# EAGLE schematic 1.0 (EAGLE 9.3.2)
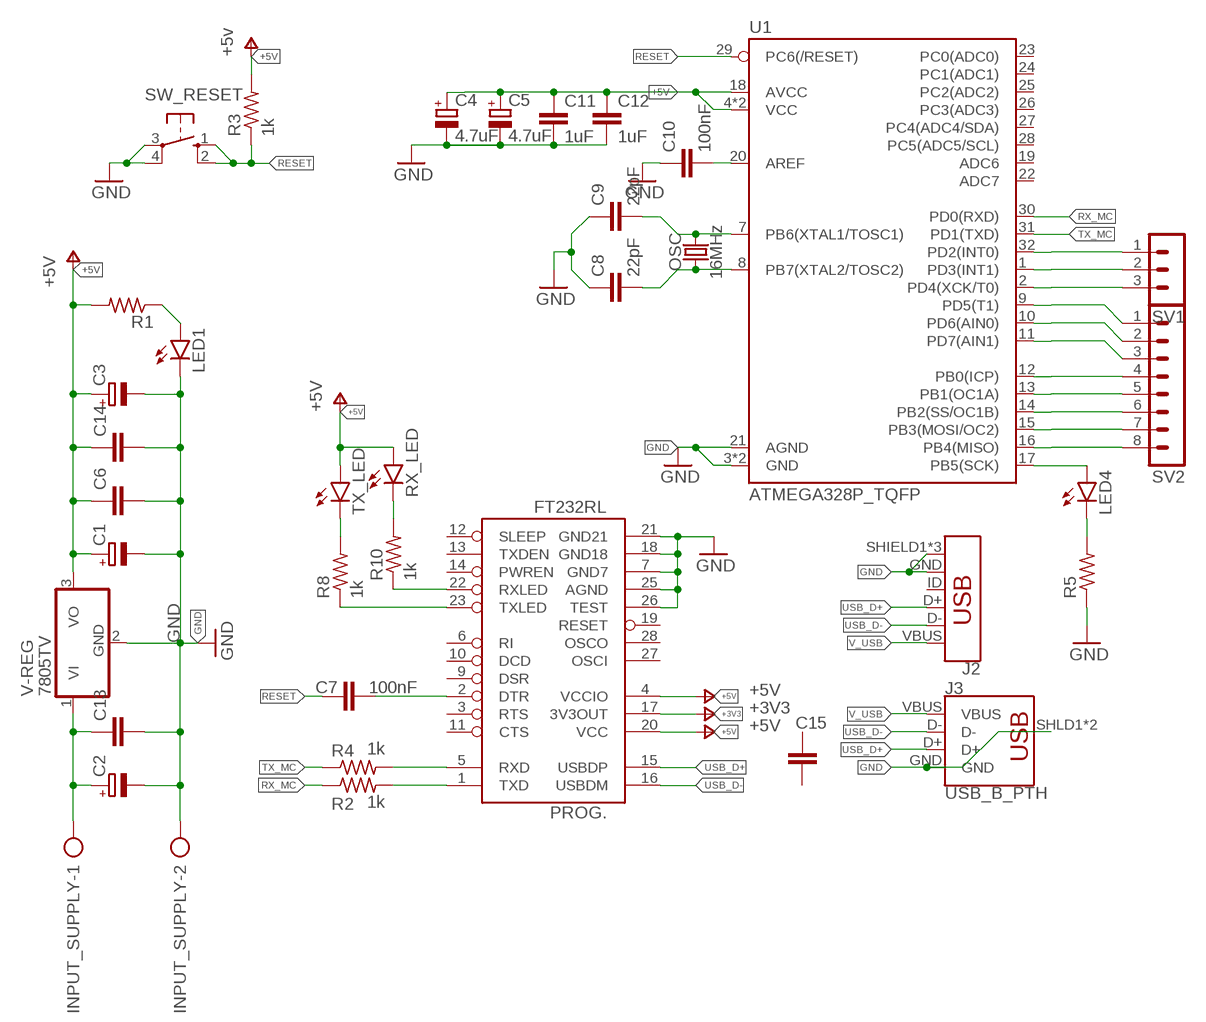
[diagram p0: schematic, sheet 1]

## Parts
C1  CPOL-EUE5-10.5  [E5-10,5]
C2  CPOL-EUE5-10.5  [E5-10,5]
C3  CPOL-EUE5-10.5  [E5-10,5]
C4  4.7uF  CPOL-EUE5-10.5  [E5-10,5]
C5  4.7uF  CPOL-EUE5-10.5  [E5-10,5]
C6  C-EU050-030X075  [C050-030X075]
C7  100nF  C-EU050-030X075  [C050-030X075]
C8  22pF  C-EU050-030X075  [C050-030X075]
C9  22pF  C-EU050-030X075  [C050-030X075]
C10  100nF  C-EU050-030X075  [C050-030X075]
C11  1uF  C-EU050-030X075  [C050-030X075]
C12  1uF  C-EU050-030X075  [C050-030X075]
C13  C-EU050-030X075  [C050-030X075]
C14  C-EU050-030X075  [C050-030X075]
C15  C-EU050-030X075  [C050-030X075]
INPUT_SUPPLY  SMKDSP_1,5/2  [SMKDSP_1,5/2]
J2  USB_MICRO-B_FEMALE-SMT  [USB-B-MICRO-SMD]
J3  USB_B_PTH  [USB-B-PTH]
LED1  LED5MM  [LED5MM]
LED4  LED5MM  [LED5MM]
OSC  16MHz  CRYSTALPTH-HC49UV  [HC49U]
PROG.  FT232RL  FT232RLSSOP  [SSOP28DB]
R1  R-US_0207/10  [0207/10]
R2  1k  R-US_0207/10  [0207/10]
R3  1k  R-US_0207/10  [0207/10]
R4  1k  R-US_0207/10  [0207/10]
R5  R-US_0207/10  [0207/10]
R8  1k  R-US_0207/10  [0207/10]
R10  1k  R-US_0207/10  [0207/10]
RX_LED  LED5MM  [LED5MM]
SV1  MA03-1  [MA03-1]
SV2  MA08-1  [MA08-1]
SW_RESET  10-XX  [B3F-10XX]
TX_LED  LED5MM  [LED5MM]
U1  ATMEGA328P_TQFP  [TQFP32-08]
V-REG  7805TV  [TO220V]

## Nets
+3V3: PROG..17(3V3OUT)
+5V: C1.+ C3.+ C4.+ C5.+ C6.1 C11.1 C12.1 C14.1 PROG..4(VCCIO) PROG..20(VCC) R1.2 R3.2 RX_LED.A TX_LED.A U1.4(VCC) U1.6(VCC) U1.18(AVCC) V-REG.3(VO) ; supply symbol labelled +5v
GND: C1.- C2.- C3.- C4.- C5.- C6.2 C8.1 C9.1 C10.1 C11.2 C12.2 C13.2 C14.2 INPUT_SUPPLY.2 J2.GND J2.SHIELD1(SHIELD) J2.SHIELD2(SHIELD) J2.SHIELD3(SHIELD) J3.GND J3.SHLD1(SHIELD) J3.SHLD2(SHIELD) LED1.K(C) PROG..7(GND7) PROG..18(GND18) PROG..21(GND21) PROG..25(AGND) PROG..26(TEST) R5.1 SW_RESET.3(P) SW_RESET.4(P1) U1.3(GND) U1.5(GND) U1.21(AGND) V-REG.2(GND)
N$1: C2.+ C13.1 INPUT_SUPPLY.1 V-REG.1(VI)
N$2: LED1.A R1.1
N$3: PROG..5(RXD) R4.2
N$4: PROG..1(TXD) R2.2
N$5: C7.2 PROG..2(DTR)
N$6: C9.2 OSC.2 U1.7(PB6(XTAL1/TOSC1))
N$7: C8.2 OSC.1 U1.8(PB7(XTAL2/TOSC2))
N$8: PROG..22(RXLED) R10.1
N$9: PROG..23(TXLED) R8.1
N$10: R8.2 TX_LED.K(C)
N$11: R10.2 RX_LED.K(C)
N$12: C10.2 U1.20(AREF)
N$13: LED4.K(C) R5.2
N$14: LED4.A U1.17(PB5(SCK))
N$15: SV1.1 U1.32(PD2(INT0))
N$16: SV1.2 U1.1(PD3(INT1))
N$17: SV1.3 U1.2(PD4(XCK/T0))
N$18: SV2.1 U1.9(PD5(T1))
N$19: SV2.2 U1.10(PD6(AIN0))
N$20: SV2.3 U1.11(PD7(AIN1))
N$21: SV2.4 U1.12(PB0(ICP))
N$22: SV2.5 U1.13(PB1(OC1A))
N$23: SV2.6 U1.14(PB2(SS/OC1B))
N$24: SV2.7 U1.15(PB3(MOSI/OC2))
N$25: SV2.8 U1.16(PB4(MISO))
RESET: C7.1 R3.1 SW_RESET.1(S) SW_RESET.2(S1) U1.29(PC6(/RESET))
RX_MC: R2.1 U1.30(PD0(RXD))
TX_MC: R4.1 U1.31(PD1(TXD))
USB_D+: J2.D+ J3.D+ PROG..15(USBDP)
USB_D-: J2.D- J3.D- PROG..16(USBDM)
V_USB: J2.VBUS J3.VBUS
Unconnected: C15.1 C15.2 J2.ID PROG..3(RTS) PROG..6(RI) PROG..9(DSR) PROG..10(DCD) PROG..11(CTS) PROG..12(SLEEP) PROG..13(TXDEN) PROG..14(PWREN) PROG..19(RESET) PROG..27(OSCI) PROG..28(OSCO) U1.19(ADC6) U1.22(ADC7) U1.23(PC0(ADC0)) U1.24(PC1(ADC1)) U1.25(PC2(ADC2)) U1.26(PC3(ADC3)) U1.27(PC4(ADC4/SDA)) U1.28(PC5(ADC5/SCL))

## Library data of the parts
C1-C5 = rcl:CPOL-EU: POLARIZED CAPACITOR, European symbol; SPICEPREFIX: C
C6-C15 = rcl:C-EU: CAPACITOR, European symbol; SPICEPREFIX: C
INPUT_SUPPLY = con-phoenix-smkdsp:SMKDSP_1,5/2: Printklemme, Nennstrom: 17,5 A, Bemessungsspannung: 250 V, Raster: 5,0 mm Source: http://eshop.phoenixcontact.de .. 1733415.pdf; MF: FARNELL; MPN: 1733570; OC_FARNELL: 3041244; OC_NEWARK: 69C8588
J2 = SparkFun-Connectors:USB_MICRO-B: USB Type Micro-B Connector Male/female and PTH/SMT variants SparkFun Products: SparkFun microB USB Breakout <https://www.sparkfun.com/products/12035> SparkFun USB microB Plug Breakout <https://www.sparkfun.com/products/10031> SparkFun ESP8266 Thing <https://www.sparkfun.com/products/13231>; PROD_ID: CONN-11752
J3 = SparkFun-Connectors:USB_B: USB Type B Connector SparkFun Products: SparkFun Stepoko <https://www.sparkfun.com/products/13899> PTH; PROD_ID: CONN-08278; SF_ID: PRT-00139
LED1 LED4 RX_LED TX_LED = led:LED: LED OSRAM: - CHIPLED LG R971, LG N971, LY N971, LG Q971, LY Q971, LO R971, LY R971 LH N974, LH R974 LS Q976, LO Q976, LY Q976 LO Q996 - Hyper CHIPLED LW Q18S LB Q993, LB Q99A, LB R99A - SideLED LS A670, LO A670, LY A670, LG A670, LP A670 LB A673, LV A673, LT A673, LW A673 LH A674 LY A675 LS A676, LA A676, LO A676, LY A676, LW A676 LS A679, LY A679, LG A679 - Hyper Micro SIDELED® LS Y876, LA Y876, LO Y876, LY Y876 LT Y87S - SmartLED LW L88C, LW L88S LB L89C, LB L89S, LG L890 LS L89K, LO L89K, LY L89K LS L896, LA L896, LO L896, LY L896 - TOPLED LS T670, LO T670, LY T670, LG T670, LP T670 LSG T670, LSP T670, LSY T670, LOP T670, LYG T670 LG T671, LOG T671, LSG T671 LB T673, LV T673, LT T673, LW T673 LH T674 LS T676, LA T676, LO T676, LY T676, LB T676, LH T676, LSB T676, LW T676 LB T67C, LV T67C, LT T67C, LS T67K, LO T67K, LY T67K, LW E67C LS E67B, LA E67B, LO E67B, LY E67B, LB E67C, LV E67C, LT E67C LW T67C LS T679, LY T679, LG T679 LS T770, LO T770, LY T770, LG T770, LP T770 LB T773, LV T773, LT T773, LW T773 LH T774 LS E675, LA E675, LY E675, LS T675 LS T776, LA T776, LO T776, LY T776, LB T776 LHGB T686 LT T68C, LB T68C - Hyper Mini TOPLED® LB M676 - Mini TOPLED Santana® LG M470 LS M47K, LO M47K, LY M47K Source: http://www.osram.convergy.de LUXEON: - LUMILED® LXK2-PW12-R00, LXK2-PW12-S00, LXK2-PW14-U00, LXK2-PW14-V00 LXK2-PM12-R00, LXK2-PM12-S00, LXK2-PM14-U00 LXK2-PE12-Q00, LXK2-PE12-R00, LXK2-PE12-S00, LXK2-PE14-T00, LXK2-PE14-U00 LXK2-PB12-K00, LXK2-PB12-L00, LXK2-PB12-M00, LXK2-PB14-N00, LXK2-PB14-P00, LXK2-PB14-Q00 LXK2-PR12-L00, LXK2-PR12-M00, LXK2-PR14-Q00, LXK2-PR14-R00 LXK2-PD12-Q00, LXK2-PD12-R00, LXK2-PD12-S00 LXK2-PH12-R00, LXK2-PH12-S00 LXK2-PL12-P00, LXK2-PL12-Q00, LXK2-PL12-R00 Source: www.luxeon.com KINGBRIGHT: KA-3528ASYC Source: www.kingbright.com
OSC = SparkFun-Clocks:CRYSTAL: Crystals (Generic) These are passive quartz crystals, which can be used as a clock source for a microcontroller. Crystal's are two-terminal devices. They require external "load" capacitors to generate an oscillating signal.
PROG. = SparkFun-IC-Comms:FT232RL: FT232RL USB UART FT232RL 4th Generation USB UART (USB <-> Serial) Controller. Datasheet <http://www.sparkfun.com/datasheets/IC/FT232R_v104.pdf> SparkFun Products Component <https://www.sparkfun.com/products/650> (COM-00650) SparkFun RedBot Mainboard <https://www.sparkfun.com/products/12097> (ROB-12097) SparkFun FTDI Basic Breakout - 5V <https://www.sparkfun.com/products/9716> (DEV-09716) SparkFun FTDI Basic Breakout - 3.3V <https://www.sparkfun.com/products/9873> (DEV-09873) Bus Pirate - v3.6a <https://www.sparkfun.com/products/12942> (TOL-12942) SparkFun USB to Serial Breakout - FT232RL <https://www.sparkfun.com/products/12731> (BOB-12731) SparkFun PicoBoard <https://www.sparkfun.com/products/11888> (WIG-11888) SparkFun RFID USB Reader <https://www.sparkfun.com/products/9963> (SEN-09963) LilyPad FTDI Basic Breakout - 5V <https://www.sparkfun.com/products/10275> (DEV-10275) SparkFun Stepoko <https://www.sparkfun.com/products/13899> (ROB-13899); PROD_ID: IC-00870
R1-R5 R8 R10 = rcl:R-US_: RESISTOR, American symbol; SPICEPREFIX: R
SV1 = con-lstb:MA03-1: PIN HEADER; OC_FARNELL: unknown; OC_NEWARK: unknown
SV2 = con-lstb:MA08-1: PIN HEADER; OC_FARNELL: unknown; OC_NEWARK: unknown
SW_RESET = switch-omron:10-XX: OMRON SWITCH; MPN: B3F-1000; OC_FARNELL: 176432; OC_NEWARK: 36M3542
U1 = SparkFun-IC-Microcontroller:ATMEGA328P_TQFP: Popular 328P in QFP Storefront component: ATmega328 - TQFP <https://www.sparkfun.com/products/13448> (COM-13448) Datasheet <http://www.sparkfun.com/datasheets/Components/SMD/ATMega328.pdf> SparkFun Products SparkFun RedBoard - Programmed with Arduino <https://www.sparkfun.com/products/12757> (DEV-12757) Arduino Pro Mini 328 - 5V/16MHz <https://www.sparkfun.com/products/11113> (DEV-11113) Arduino Pro Mini 328 - 3.3V/8MHz <https://www.sparkfun.com/products/11114> (DEV-11114) SparkFun OpenLog <https://www.sparkfun.com/products/13712> (DEV-13712) SparkFun MicroView - OLED Arduino Module <https://www.sparkfun.com/products/12923> (DEV-12923) SparkFun Digital Sandbox <https://www.sparkfun.com/products/12651> (DEV-12651) SparkFun PicoBoard <https://www.sparkfun.com/products/11888> (WIG-11888) Arduino Fio <https://www.sparkfun.com/products/10116> (DEV-10116) LilyPad Arduino 328 Main Board <https://www.sparkfun.com/products/13342> (DEV-13342) SparkFun RedStick <https://www.sparkfun.com/products/13741> (DEV-13741) LilyPad MP3 <https://www.sparkfun.com/products/11013> (DEV-11013) LilyPad Arduino SimpleSnap <https://www.sparkfun.com/products/10941> (DEV-10941) SparkFun Stepoko <https://www.sparkfun.com/products/13899> (ROB-13899) SparkFun Geiger Counter <https://www.sparkfun.com/products/11345> (SEN-11345) SparkFun EL Sequencer <https://www.sparkfun.com/products/12781> (COM-12781) Arduino Pro 328 - 5V/16MHz <https://www.sparkfun.com/products/10915> (DEV-10915) CryptoCape <https://www.sparkfun.com/products/12773> (DEV-12773) SparkFun IR Thermometer Evaluation Board - MLX90614 <https://www.sparkfun.com/products/10740> (SEN-10740) SparkFun RedBot Mainboard <https://www.sparkfun.com/products/12097> (ROB-12097) Arduino Pro 328 - 3.3V/8MHz <https://www.sparkfun.com/products/10914> (DEV-10914) SparkFun Block for Intel® Edison - Arduino <https://www.sparkfun.com/products/13036> (DEV-13036) SparkFun Simon Says - Surface Mount Soldering Kit <https://www.sparkfun.com/products/10935> (KIT-10935) SparkFun 7-Segment Serial Display - Red <https://www.sparkfun.com/products/11441> (COM-11441) SparkFun 7-Segment Serial Display - White <https://www.sparkfun.com/products/11629> (COM-11629) SparkFun 7-Segment Serial Display - Yellow <https://www.sparkfun.com/products/11443> (COM-11443) SparkFun 7-Segment Serial Display - Kelly Green <https://www.sparkfun.com/products/11440> (COM-11440) SparkFun 7-Segment Serial Display - Blue <https://www.sparkfun.com/products/11442> (COM-11442) SparkFun OpenSegment Serial Display - 20mm (Blue) <https://www.sparkfun.com/products/11647> (COM-11647) SparkFun OpenSegment Serial Display - 20mm (Green) <https://www.sparkfun.com/products/11646> (COM-11646) SparkFun OpenSegment Serial Display - 20mm (White) <https://www.sparkfun.com/products/11648> (COM-11648) SparkFun OpenSegment Serial Display - 20mm (Red) <https://www.sparkfun.com/products/11644> (COM-11644) SparkFun OpenSegment Serial Display - 20mm (Yellow) <https://www.sparkfun.com/products/11645> (COM-11645) SparkFun OpenSegment Shield <https://www.sparkfun.com/products/13190> (DEV-13190); PROD_ID: IC-09069
V-REG = linear:78*: Positive VOLTAGE REGULATOR Source: http://cache.national.com/ds/LM/LM78L05.pdf http://www.fairchildsemi.com/ds/LM/LM7805.pdf